# Altium schematic sheet USB3HUB.SchDoc
size A3; SheetNumber: 13; SheetTotal: 13
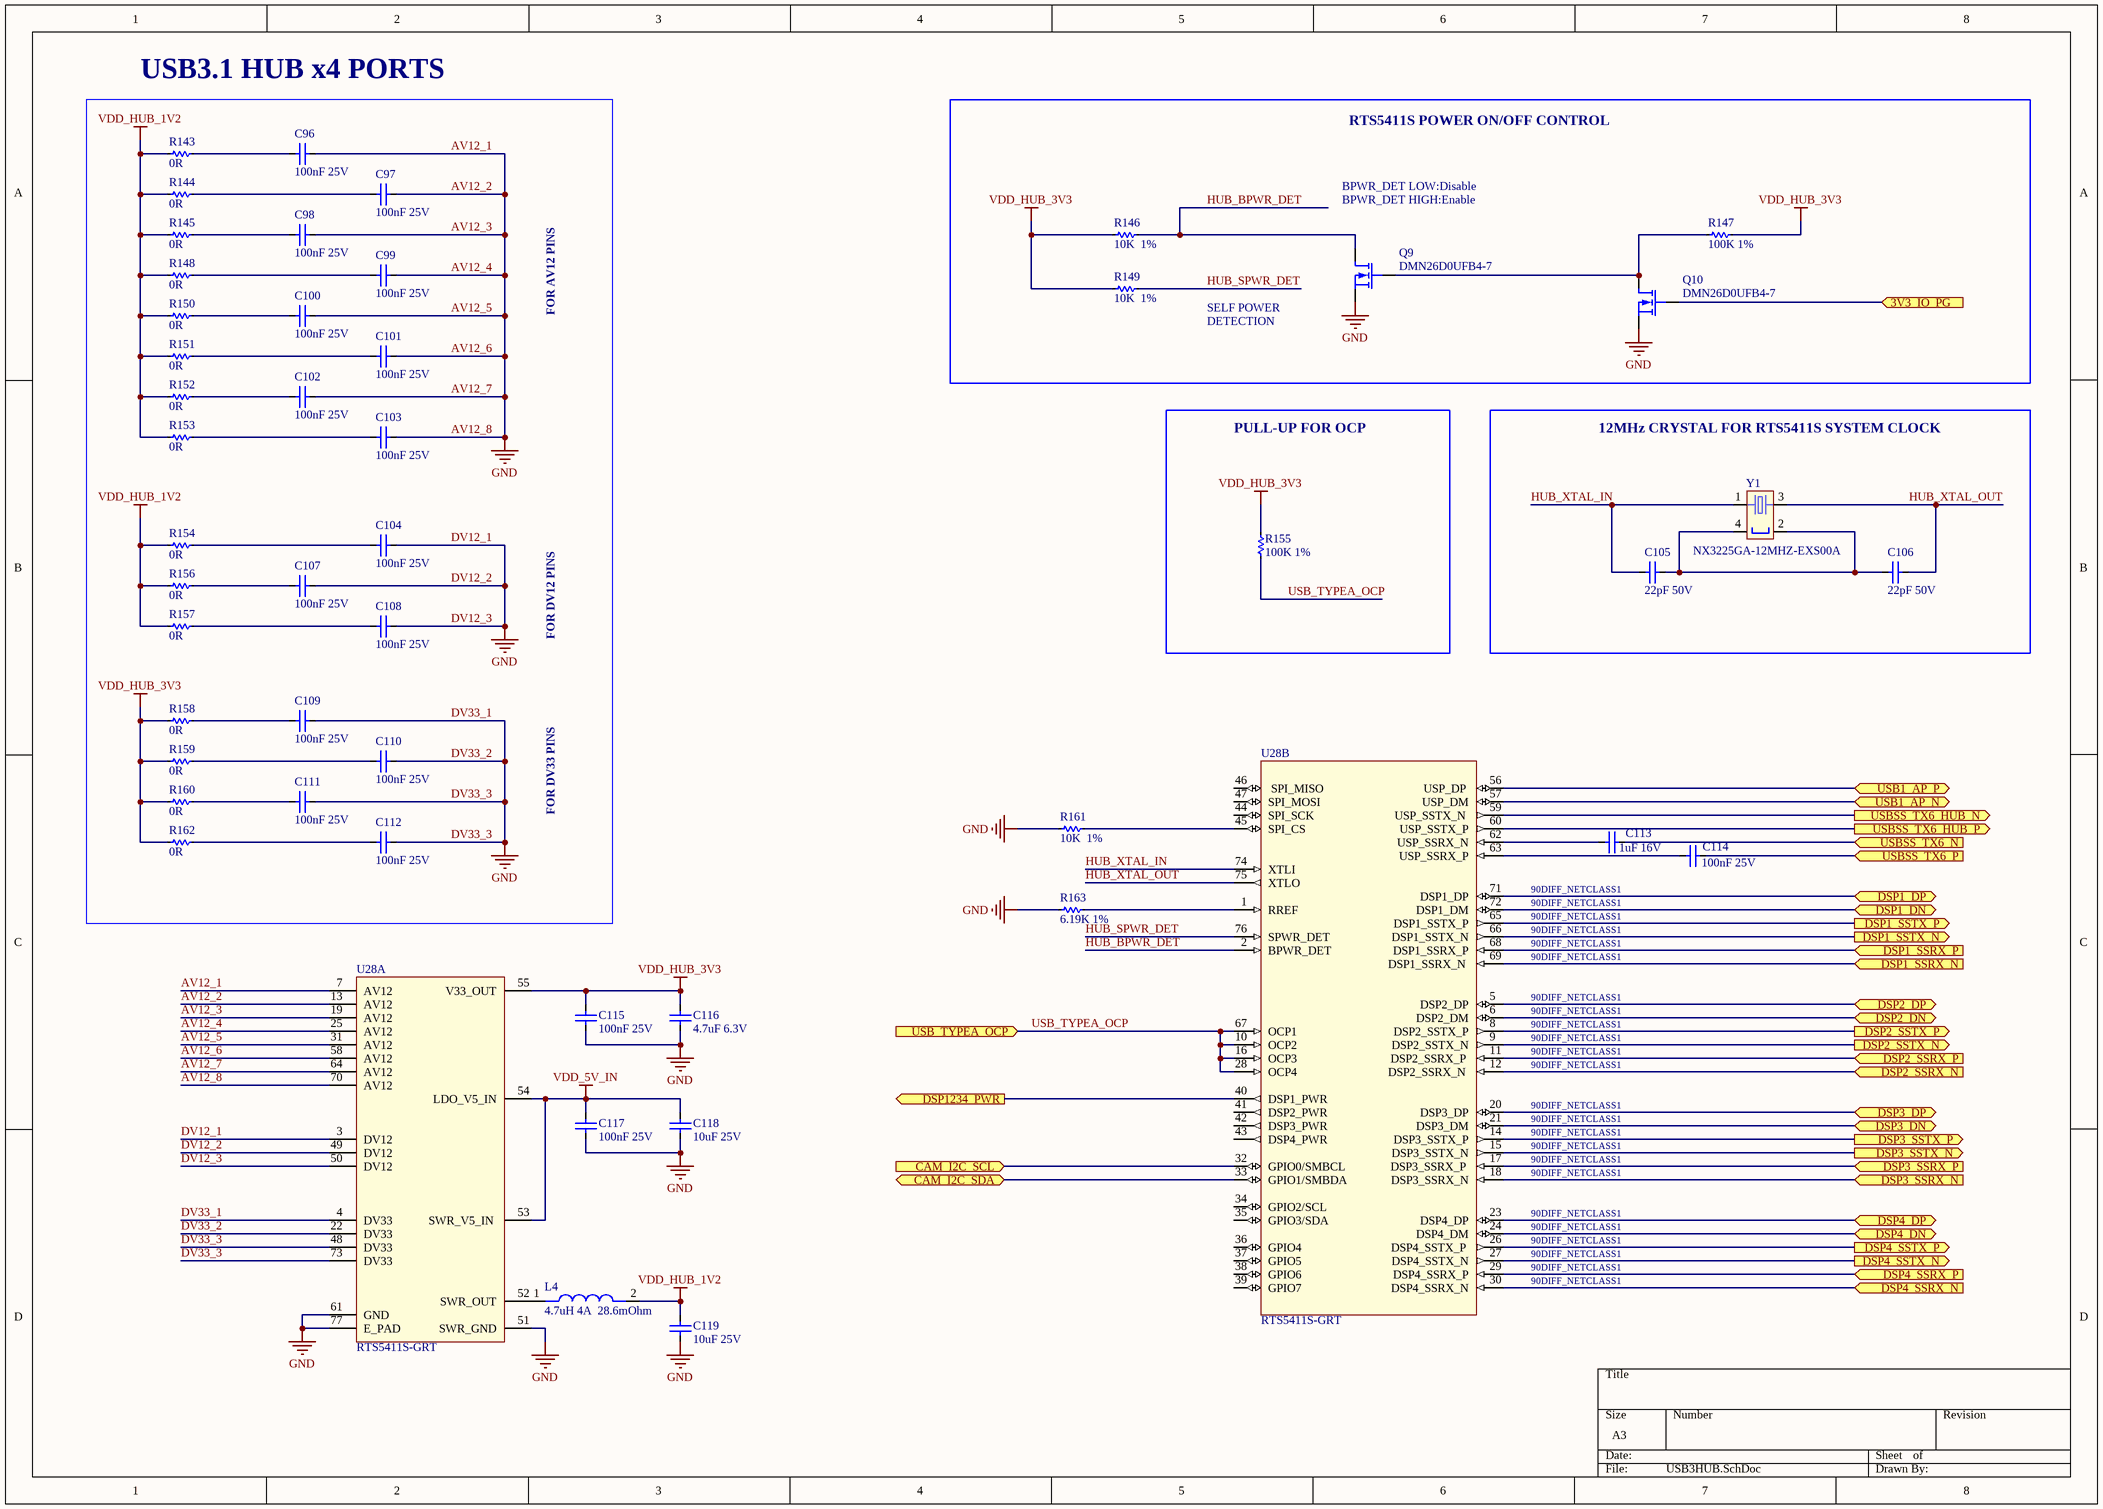
[diagram p0: USB3HUB.SchDoc]

## Parts
C96  100nF 25V  [C0402]
C97  100nF 25V  [C0402]
C98  100nF 25V  [C0402]
C99  100nF 25V  [C0402]
C100  100nF 25V  [C0402]
C101  100nF 25V  [C0402]
C102  100nF 25V  [C0402]
C103  100nF 25V  [C0402]
C104  100nF 25V  [C0402]
C105  22pF 50V  [C0402]
C106  22pF 50V  [C0402]
C107  100nF 25V  [C0402]
C108  100nF 25V  [C0402]
C109  100nF 25V  [C0402]
C110  100nF 25V  [C0402]
C111  100nF 25V  [C0402]
C112  100nF 25V  [C0402]
C113  1uF 16V  [C0603]
C114  100nF 25V  [C0402]
C115  100nF 25V  [C0402]
C116  4.7uF 6.3V  [C0402]
C117  100nF 25V  [C0402]
C118  10uF 25V  [C0805]
C119  10uF 25V  [C0805]
L4  4.7uH 4A  28.6mOhm  [NRS8030T4R7MJGJV]
Q9  DMN26D0UFB4-7  [DFN1006-3]
Q10  DMN26D0UFB4-7  [DFN1006-3]
R143  0R  [R0603]
R144  0R  [R0603]
R145  0R  [R0603]
R146  10K  1%  [R0402]
R147  100K 1%  [R0402]
R148  0R  [R0603]
R149  10K  1%  [R0402]
R150  0R  [R0603]
R151  0R  [R0603]
R152  0R  [R0603]
R153  0R  [R0603]
R154  0R  [R0603]
R155  100K 1%  [R0402]
R156  0R  [R0603]
R157  0R  [R0603]
R158  0R  [R0603]
R159  0R  [R0603]
R160  0R  [R0603]
R161  10K  1%  [R0402]
R162  0R  [R0603]
R163  6.19K 1%  [R0402]
U28  RTS5411S-GRT  [QFN-76]  (parts A,B of 2)
Y1  NX3225GA-12MHZ-EXS00A  [NX3225GA-12MHZ-EXS00A-CG07042]

## Blocks framed on the sheet
USB3.1 HUB x4 PORTS: C96-C104 C107-C112 R143-R145 R148 R150-R154 R156-R160 R162
RTS5411S POWER ON/OFF CONTROL: Q9 Q10 R146 R147 R149
PULL-UP FOR OCP: R155
12MHz CRYSTAL FOR RTS5411S SYSTEM CLOCK: C105 C106 Y1

## Ports
3V3_IO_PG (in), CAM_I2C_SCL (in), CAM_I2C_SDA (bidir), DSP1_DN (bidir), DSP1_DP (bidir), DSP1_SSRX_N (in), DSP1_SSRX_P (in), DSP1_SSTX_N (out), DSP1_SSTX_P (out), DSP2_DN (bidir), DSP2_DP (bidir), DSP2_SSRX_N (in), DSP2_SSRX_P (in), DSP2_SSTX_N (out), DSP2_SSTX_P (out), DSP3_DN (bidir), DSP3_DP (bidir), DSP3_SSRX_N (in), DSP3_SSRX_P (in), DSP3_SSTX_N (out), DSP3_SSTX_P (out), DSP4_DN (bidir), DSP4_DP (bidir), DSP4_SSRX_N (in), DSP4_SSRX_P (in), DSP4_SSTX_N (out), DSP4_SSTX_P (out), DSP1234_PWR (out), USB1_AP_N (bidir), USB1_AP_P (bidir), USB_TYPEA_OCP (in), USBSS_TX6_HUB_N (out), USBSS_TX6_HUB_P (out), USBSS_TX6_N (in), USBSS_TX6_P (in)

## Nets
AV12_1: C96.2 C97.2 C98.2 C99.2 C100.2 C101.2 C102.2 C103.2 C104.2 C107.2 C108.2 C109.2 C110.2 C111.2 C112.2 C115.1 C116.1 C117.1 C118.1 C119.1 Q9.2(S) Q10.2(S) R161.1 R163.1 U28.3(DV12) U28.4(DV33) U28.7(AV12) U28.13(AV12) U28.19(AV12) U28.22(DV33) U28.25(AV12) U28.31(AV12) U28.48(DV33) U28.49(DV12) U28.50(DV12) U28.51(SWR_GND) U28.58(AV12) U28.61(GND) U28.64(AV12) U28.70(AV12) U28.73(DV33) U28.77(E_PAD)  [also labelled AV12_2, AV12_3, AV12_4, AV12_5, AV12_6, AV12_7, AV12_8, DV12_1, DV12_2, DV12_3, DV33_1, DV33_2, DV33_3, GND]
VDD_5V_IN: C117.2 C118.2 U28.53(SWR_V5_IN) U28.54(LDO_V5_IN)
VDD_HUB_1V2: C119.2 L4.2 R143.1 R144.1 R145.1 R148.1 R150.1 R151.1 R152.1 R153.1 R154.1 R156.1 R157.1
VDD_HUB_3V3: C115.2 C116.2 R146.1 R147.2 R149.1 R155.2 R158.1 R159.1 R160.1 R162.1 U28.55(V33_OUT)
3V3_IO_PG: Q10.1(G) ; port 3V3_IO_PG
CAM_I2C_SCL: U28.32(GPIO0/SMBCL) ; port CAM_I2C_SCL
CAM_I2C_SDA: U28.33(GPIO1/SMBDA) ; port CAM_I2C_SDA
DSP1_DN: U28.72(DSP1_DM) ; port DSP1_DN
DSP1_DP: U28.71(DSP1_DP) ; port DSP1_DP
DSP1_SSRX_N: U28.69(DSP1_SSRX_N) ; port DSP1_SSRX_N
DSP1_SSRX_P: U28.68(DSP1_SSRX_P) ; port DSP1_SSRX_P
DSP1_SSTX_N: U28.66(DSP1_SSTX_N) ; port DSP1_SSTX_N
DSP1_SSTX_P: U28.65(DSP1_SSTX_P) ; port DSP1_SSTX_P
DSP2_DN: U28.6(DSP2_DM) ; port DSP2_DN
DSP2_DP: U28.5(DSP2_DP) ; port DSP2_DP
DSP2_SSRX_N: U28.12(DSP2_SSRX_N) ; port DSP2_SSRX_N
DSP2_SSRX_P: U28.11(DSP2_SSRX_P) ; port DSP2_SSRX_P
DSP2_SSTX_N: U28.9(DSP2_SSTX_N) ; port DSP2_SSTX_N
DSP2_SSTX_P: U28.8(DSP2_SSTX_P) ; port DSP2_SSTX_P
DSP3_DN: U28.21(DSP3_DM) ; port DSP3_DN
DSP3_DP: U28.20(DSP3_DP) ; port DSP3_DP
DSP3_SSRX_N: U28.18(DSP3_SSRX_N) ; port DSP3_SSRX_N
DSP3_SSRX_P: U28.17(DSP3_SSRX_P) ; port DSP3_SSRX_P
DSP3_SSTX_N: U28.15(DSP3_SSTX_N) ; port DSP3_SSTX_N
DSP3_SSTX_P: U28.14(DSP3_SSTX_P) ; port DSP3_SSTX_P
DSP4_DN: U28.24(DSP4_DM) ; port DSP4_DN
DSP4_DP: U28.23(DSP4_DP) ; port DSP4_DP
DSP4_SSRX_N: U28.30(DSP4_SSRX_N) ; port DSP4_SSRX_N
DSP4_SSRX_P: U28.29(DSP4_SSRX_P) ; port DSP4_SSRX_P
DSP4_SSTX_N: U28.27(DSP4_SSTX_N) ; port DSP4_SSTX_N
DSP4_SSTX_P: U28.26(DSP4_SSTX_P) ; port DSP4_SSTX_P
DSP1234_PWR: U28.40(DSP1_PWR) ; port DSP1234_PWR
HUB_BPWR_DET: Q9.3(D) R146.2 U28.2(BPWR_DET)
HUB_SPWR_DET: R149.2 U28.76(SPWR_DET)
HUB_XTAL_IN: C105.1 U28.74(XTLI) Y1.1
HUB_XTAL_OUT: C106.1 U28.75(XTLO) Y1.3
USB1_AP_N: U28.57(USP_DM) ; port USB1_AP_N
USB1_AP_P: U28.56(USP_DP) ; port USB1_AP_P
USB_TYPEA_OCP: R155.1 U28.10(OCP2) U28.16(OCP3) U28.28(OCP4) U28.67(OCP1) ; port USB_TYPEA_OCP
USBSS_TX6_HUB_N: U28.59(USP_SSTX_N) ; port USBSS_TX6_HUB_N
USBSS_TX6_HUB_P: U28.60(USP_SSTX_P) ; port USBSS_TX6_HUB_P
USBSS_TX6_N: C113.2 ; port USBSS_TX6_N
USBSS_TX6_P: C114.2 ; port USBSS_TX6_P
NetC96_1: C96.1 R143.2
NetC97_1: C97.1 R144.2
NetC98_1: C98.1 R145.2
NetC99_1: C99.1 R148.2
NetC100_1: C100.1 R150.2
NetC101_1: C101.1 R151.2
NetC102_1: C102.1 R152.2
NetC103_1: C103.1 R153.2
NetC104_1: C104.1 R154.2
NetC105_2: C105.2 C106.2 Y1.2(GND) Y1.4(GND)
NetC107_1: C107.1 R156.2
NetC108_1: C108.1 R157.2
NetC109_1: C109.1 R158.2
NetC110_1: C110.1 R159.2
NetC111_1: C111.1 R160.2
NetC112_1: C112.1 R162.2
NetC113_1: C113.1 U28.62(USP_SSRX_N)
NetC114_1: C114.1 U28.63(USP_SSRX_P)
NetL4_1: L4.1 U28.52(SWR_OUT)
NetQ9_1: Q9.1(G) Q10.3(D) R147.1
NetR161_2: R161.2 U28.45(SPI_CS)
NetR163_2: R163.2 U28.1(RREF)

Not connected (* = marked no-connect by the designer): U28 34(GPIO2/SCL) 35(GPIO3/SDA) 36(GPIO4) 37(GPIO5) 38(GPIO6) 39(GPIO7) 41(DSP2_PWR) 42(DSP3_PWR) 43(DSP4_PWR) 44(SPI_SCK) 46(_SPI_MISO) 47(SPI_MOSI)

## Notes on the sheet
- BPWR_DET LOW:Disable
- BPWR_DET HIGH:Enable
- FOR AV12 PINS
- SELF POWER
- DETECTION
- FOR DV12 PINS
- FOR DV33 PINS
- 90DIFF_NETCLASS1

## Library data of the parts
C96-C104 C107-C112 C114 C115 C117 = TMK105BJ104KV-F: CAP CER 0.1UF 25V X5R 0402 / High Value Multilayer Ceramic Capacitors (High dielectric type); Manufacturer: Taiyo Yuden; Tolerance: 10%; Supplier 1: Digi-Key; Manufacturer Part Number: TMK105BJ104KV-F; RoHS: Yes; Category: Ceramic Capacitors; Stock 1: 11997960; Pricing 1: 1=0.10000, 10=0.03700, 50=0.02000, 100=0.01630, 500=0.01166, 1000=0.00917, 2500=0.00833, 5000=0.00767 (USD); Mount: Surface Mount; Case/Package: 0402; Number of Pins: 2; Case Code (Imperial): 0402; Case Code (Metric): 1005; Weight: 2.3E-05oz; Min Operating Temperature: -55°C; Max Operating Temperature: 85°C; Capacitance: 100nF; Packaging: Tape and Reel; Dielectric: X5R; Voltage Rating (DC): 25V; Voltage Rating: 25V; Package Quantity: 1; Termination: SMD/SMT; Resistor Type: Ceramic; Voltage: 25V; Series: M; Construction: Flat; Length: 1mm; Width: 0.02inch; Height: 0.5mm; Depth: 0.5mm; Thickness: 0.022inch; Reach SVHC Compliant: Yes; Lead Free: Lead Free; Halogen Free: Halogen Free; RoHS Compliant: Yes; Supplier Part Number 1: 587-1456-1-ND
C105 C106 = GRM1555C1H220JA01D: 0402 22pF 50V ±5 % Tolerance C0G SMT Multilayer Ceramic Capacitor; Manufacturer: Murata; Tolerance: 5%; Supplier 1: Mouser; Manufacturer Part Number: GRM1555C1H220JA01D; RoHS: Yes; Category: Ceramic Capacitors; Stock 1: 799894; Pricing 1: 1=0.10000, 10=0.01000, 50=0.01000, 100=0.00800, 1000=0.00500, 10000=0.00300 (USD); Mount: Surface Mount; Case/Package: 0402; Case Code (Metric): 1005; Case Code (Imperial): 0402; Material: Ceramic; Min Operating Temperature: -55°C; Max Operating Temperature: 125°C; Capacitance: 22pF; Voltage Rating: 50V; Packaging: Tape and Reel; Voltage Rating (DC): 50V; Package Quantity: 1; Dielectric: C0G; Termination: SMD/SMT; Voltage: 50V; Series: GRM; Construction: Flat; Length: 1mm; Width: 0.02inch; Height: 0.5mm; Thickness: 0.022inch; Depth: 0.5mm; Radiation Hardening: No; Reach SVHC Compliant: Yes; Lead Free: Lead Free; RoHS Compliant: Yes; ComponentLink1URL: https://datasheet.ciiva.com/6277/product-6277809.pdf?src-supplier=Digi-Key; ComponentLink1Description: https://datasheet.ciiva.com/6277/product-6277809.pdf?src-supplier=Digi-Key; ComponentLink2URL: https://datasheet.ciiva.com/18184/getdatasheetpartid-316063-18184267.pdf?src-supplier=Verical; ComponentLink2Description: https://datasheet.ciiva.com/18184/getdatasheetpartid-316063-18184267.pdf?src-supplier=Verical; ComponentLink3URL: https://datasheet.ciiva.com/29200/453714-da-01-en-vs-kondensator-0402-29200051.pdf?src-supplier=Conrad; ComponentLink3Description: https://datasheet.ciiva.com/29200/453714-da-01-en-vs-kondensator-0402-29200051.pdf?src-supplier=Conrad; ComponentLink4URL: https://datasheet.ciiva.com/7828/1666664-7828846.pdf?src-supplier=Element14; ComponentLink4Description: https://datasheet.ciiva.com/7828/1666664-7828846.pdf?src-supplier=Element14; ComponentLink5URL: https://datasheet.ciiva.com/16440/l0005e-16440552.pdf?src-supplier=Future+Electronics; ComponentLink5Description: https://datasheet.ciiva.com/16440/l0005e-16440552.pdf?src-supplier=Future+Electronics; Supplier Part Number 1: 81-GRM1555C1H220JA1D
C113 = 0603YD105KAT2A: 0603 1 uF 16 V ±10 % Tolerance X5R Surface Mount Multilayer Ceramic Capacitor; Manufacturer: Kyocera AVX; Tolerance: 10%; Dissipation Factor: 12.5%; Insulation Resistance: 10GR; Supplier 1: Digi-Key; Manufacturer Part Number: 0603YD105KAT2A; RoHS: Yes; Category: Ceramic Capacitors; Stock 1: 1533757; Pricing 1: 1=0.12000, 10=0.08200, 50=0.04660, 100=0.03870, 500=0.02710, 1000=0.02244 (USD); Mount: Surface Mount; Case/Package: 0603; Number of Pins: 2; Case Code (Metric): 1608; Case Code (Imperial): 0603; Min Operating Temperature: -55°C; Max Operating Temperature: 85°C; Capacitance: 1uF; Voltage Rating (DC): 16V; Packaging: Tape and Reel; Dielectric: X5R; Voltage: 16V; Voltage Rating: 16V; Package Quantity: 1; Termination: SMD/SMT; Series: -; Construction: Flat; Length: 1.6mm; Width: 0.032inch; Height: 0.9mm; Depth: 0.81mm; Thickness: 0.035inch; Radiation Hardening: No; Reach SVHC Compliant: Yes; Lead Free: Lead Free; RoHS Compliant: Yes; ComponentLink1URL: https://datasheet.ciiva.com/11788/0900766b80def1a5-11788563.pdf?src-supplier=RSComponents; ComponentLink1Description: https://datasheet.ciiva.com/11788/0900766b80def1a5-11788563.pdf?src-supplier=RSComponents; ComponentLink2URL: https://datasheet.ciiva.com/34303/2012654-34303835.pdf?src-supplier=Jameco; ComponentLink2Description: https://datasheet.ciiva.com/34303/2012654-34303835.pdf?src-supplier=Jameco; ComponentLink3URL: https://datasheet.ciiva.com/2987/cx5r-2987890.pdf?src-supplier=Avnet; ComponentLink3Description: https://datasheet.ciiva.com/2987/cx5r-2987890.pdf?src-supplier=Avnet; ComponentLink4URL: https://datasheet.ciiva.com/5412/cx5r-5412550.pdf?src-supplier=Mouser; ComponentLink4Description: https://datasheet.ciiva.com/5412/cx5r-5412550.pdf?src-supplier=Mouser; ComponentLink5URL: https://datasheet.ciiva.com/150/cx5r-150392.pdf?src-supplier=Digi-Key; ComponentLink5Description: https://datasheet.ciiva.com/150/cx5r-150392.pdf?src-supplier=Digi-Key; ComponentLink6URL: https://datasheet.ciiva.com/14590/70001028-14590632.pdf?src-supplier=Allied+Electronics; ComponentLink6Description: https://datasheet.ciiva.com/14590/70001028-14590632.pdf?src-supplier=Allied+Electronics; ComponentLink7URL: https://datasheet.ciiva.com/150/cx5r-150393.pdf?src-supplier=Digi-Key; ComponentLink7Description: https://datasheet.ciiva.com/150/cx5r-150393.pdf?src-supplier=Digi-Key; ComponentLink8URL: https://datasheet.ciiva.com/1458/84508-1458137.pdf?src-supplier=Element14; ComponentLink8Description: https://datasheet.ciiva.com/1458/84508-1458137.pdf?src-supplier=Element14; ComponentLink9URL: https://datasheet.ciiva.com/150/cx5r-150394.pdf?src-supplier=Digi-Key; ComponentLink9Description: https://datasheet.ciiva.com/150/cx5r-150394.pdf?src-supplier=Digi-Key; ComponentLink10URL: https://datasheet.ciiva.com/1458/84508-1458138.pdf?src-supplier=Element14; ComponentLink10Description: https://datasheet.ciiva.com/1458/84508-1458138.pdf?src-supplier=Element14; ComponentLink11URL: https://datasheet.ciiva.com/14586/70001028-14586715.pdf?src-supplier=Allied+Electronics; ComponentLink11Description: https://datasheet.ciiva.com/14586/70001028-14586715.pdf?src-supplier=Allied+Electronics; Supplier Part Number 1: 478-1249-1-ND
C116 = CL05A475KQ5NRNC: CAP CER 4.7UF 6.3V X5R 0402; Manufacturer: Samsung; Tolerance: 10%; Supplier 1: Mouser; Manufacturer Part Number: CL05A475KQ5NRNC; RoHS: Yes; Category: Ceramic Capacitors; Stock 1: 700040; Pricing 1: 1=0.10000, 10=0.03800, 50=0.03800, 100=0.03100, 1000=0.01800, 10000=0.01200 (USD); Mount: Surface Mount; Case/Package: 0402; Case Code (Metric): 1005; Case Code (Imperial): 0402; Contact Plating: Tin; Min Operating Temperature: -55°C; Max Operating Temperature: 85°C; Package Quantity: 1; Packaging: Tape and Reel; Capacitance: 4.7uF; Voltage Rating: 6.3V; Dielectric: X5R; Series: CL; Construction: Flat; Length: 1mm; Width: 0.02inch; Height: 0.5mm; Thickness: 0.022inch; Depth: 0.5mm; Radiation Hardening: No; Lead Free: Lead Free; RoHS Compliant: Yes; ComponentLink1URL: https://datasheet.ciiva.com/25793/cl05a475kq5nrnc-25793634.pdf?src-supplier=Digi-Key; ComponentLink1Description: https://datasheet.ciiva.com/25793/cl05a475kq5nrnc-25793634.pdf?src-supplier=Digi-Key; ComponentLink2URL: https://datasheet.ciiva.com/26838/getdatasheetpartid-353228-26838196.pdf?src-supplier=Verical; ComponentLink2Description: https://datasheet.ciiva.com/26838/getdatasheetpartid-353228-26838196.pdf?src-supplier=Verical; Supplier Part Number 1: 187-CL05A475KQ5NRNC
C118 C119 = TMK212BBJ106KG-T: 0805 10 uF 25 V ±10% Tolerance X5R SMT Multilayer Ceramic Capacitor; Manufacturer: Taiyo Yuden; Dielectric: X7R; Voltage: 16V; Supplier 1: Digi-Key; Manufacturer Part Number: TMK212BBJ106KG-T; RoHS: Yes; Category: Ceramic Capacitors; Stock 1: 3515248; Pricing 1: 1=0.18000, 10=0.12400, 50=0.07460, 100=0.06290, 500=0.04306, 1000=0.03810 (USD); Mount: Surface Mount; Case/Package: 0805; Number of Pins: 2; Case Code (Metric): 2012; Case Code (Imperial): 0805; Min Operating Temperature: -55°C; Max Operating Temperature: 85°C; Capacitance: 10uF; Tolerance: 10%; Packaging: Tape and Reel; Voltage Rating (DC): 25V; Package Quantity: 1; Voltage Rating: 25V; Termination: SMD/SMT; Resistor Type: Ceramic; Series: M; Length: 0.079inch; Width: 0.049inch; Height: 1.25mm; Thickness: 0.053inch; Lead Free: Lead Free; Reach SVHC Compliant: Yes; RoHS Compliant: Yes; ComponentLink1URL: https://datasheet.ciiva.com/30062/tmk212bbj106kg-t-30062083.pdf?src-supplier=Onlinecomponents.com; ComponentLink1Description: https://datasheet.ciiva.com/30062/tmk212bbj106kg-t-30062083.pdf?src-supplier=Onlinecomponents.com; ComponentLink2URL: https://datasheet.ciiva.com/7975/1481447-7975820.pdf?src-supplier=Element14; ComponentLink2Description: https://datasheet.ciiva.com/7975/1481447-7975820.pdf?src-supplier=Element14; ComponentLink3URL: https://datasheet.ciiva.com/139/mlcc-all-e-139571.pdf?src-supplier=Digi-Key; ComponentLink3Description: https://datasheet.ciiva.com/139/mlcc-all-e-139571.pdf?src-supplier=Digi-Key; ComponentLink4URL: https://datasheet.ciiva.com/139/mlcc-all-e-139570.pdf?src-supplier=Digi-Key; ComponentLink4Description: https://datasheet.ciiva.com/139/mlcc-all-e-139570.pdf?src-supplier=Digi-Key; ComponentLink5URL: https://datasheet.ciiva.com/139/mlcc-all-e-139572.pdf?src-supplier=Digi-Key; ComponentLink5Description: https://datasheet.ciiva.com/139/mlcc-all-e-139572.pdf?src-supplier=Digi-Key; Supplier Part Number 1: 587-2985-1-ND
L4 = NRS8030T4R7MJGJV: Inductor Power Shielded Wirewound 4.7uH 20% 100KHz Ferrite 4A 0.0286Ohm DCR 3131 Automotive T/R; Manufacturer: Taiyo Yuden; Saturation Current: 3.6A; DC Resistance (DCR): 28.6mR; Self Resonant Frequency: 40MHz; Supplier 1: Digi-Key; Manufacturer Part Number: NRS8030T4R7MJGJV; RoHS: Yes; Category: Fixed Inductors; Stock 1: 3216; Pricing 1: 1=0.64000, 10=0.56200, 25=0.52200, 50=0.44160, 100=0.40150, 250=0.37740, 500=0.33724 (USD); Mount: Surface Mount; Case/Package: Nonstandard; Core Material: Ferrite; Min Operating Temperature: -25°C; Max Operating Temperature: 125°C; Package Quantity: 1000; Packaging: Tape and Reel; Tolerance: 20%; Current Rating: 4A; Shielding: Shielded; Resistor Type: Wirewound; Inductance: 4.7uH; Test Frequency: 100kHz; Max DC Current: 4A; Termination: SMD/SMT; Length: 0.315inch; Width: 8mm; Height: 3mm; Height - Seated (Max): 0.118inch; Depth: 8mm; Ratings: AEC-Q200; Radiation Hardening: No; Halogen Free: Halogen Free; RoHS Compliant: Yes; ComponentLink1URL: https://datasheet.ciiva.com/29697/nrs8030t4r7mjgjv-ss-29697432.pdf?src-supplier=Digi-Key; ComponentLink1Description: https://datasheet.ciiva.com/29697/nrs8030t4r7mjgjv-ss-29697432.pdf?src-supplier=Digi-Key; Supplier Part Number 1: 587-3652-1-ND
Q9 Q10 = DMN26D0UFB4-7: Single N-Channel 20 V 350 mW Silicon Surface Mount Mosfet - DFN-3; Manufacturer: Diodes; Rise Time: 7.9ns; Rds On Max: 3R; Input Capacitance: 14.1pF; Continuous Drain Current (ID): 240mA; Drain to Source Resistance: 1.8R; Power Dissipation: 350mW; Turn-Off Delay Time: 13.4ns; Drain to Source Voltage (Vdss): 20V; Turn-On Delay Time: 3.8ns; Fall Time: 15.2ns; Number of Elements: 1; Gate to Source Voltage (Vgs): 10V; On-State Resistance: 10R; FET Type: 1 N-Channel; Supplier 1: Mouser; Manufacturer Part Number: DMN26D0UFB4-7; RoHS: Yes; Category: MOSFETs; Stock 1: 21043; Pricing 1: 1=0.38000, 10=0.32100, 50=0.32100, 100=0.17000, 1000=0.07700, 10000=0.05000 (USD); Mount: Surface Mount; Case/Package: DFN; Number of Pins: 3; Min Operating Temperature: -55°C; Max Operating Temperature: 150°C; Packaging: Tape and Reel; Package Quantity: 3000; Max Power Dissipation: 350mW; Element Configuration: Single; Number of Channels: 1; Polarity: N-CHANNEL; Series: -; Drain-source On Resistance-Max: 10R; Length: 1.05mm; Width: 0.65mm; Height: 0.35mm; Radiation Hardening: No; Reach SVHC Compliant: Yes; Lead Free: Lead Free; RoHS Compliant: Yes; ComponentLink1URL: https://datasheet.ciiva.com/4443/ds31775-89139-4443083.pdf?src-supplier=Mouser; ComponentLink1Description: https://datasheet.ciiva.com/4443/ds31775-89139-4443083.pdf?src-supplier=Mouser; ComponentLink2URL: https://datasheet.ciiva.com/11176/ds31775-11176556.pdf?src-supplier=Avnet; ComponentLink2Description: https://datasheet.ciiva.com/11176/ds31775-11176556.pdf?src-supplier=Avnet; ComponentLink3URL: https://datasheet.ciiva.com/16434/ds31775-16434037.pdf?src-supplier=Future+Electronics; ComponentLink3Description: https://datasheet.ciiva.com/16434/ds31775-16434037.pdf?src-supplier=Future+Electronics; ComponentLink4URL: https://datasheet.ciiva.com/48532/ds31775-48532486.pdf?src-supplier=Avnet; ComponentLink4Description: https://datasheet.ciiva.com/48532/ds31775-48532486.pdf?src-supplier=Avnet; ComponentLink5URL: https://datasheet.ciiva.com/934/ds31775-934573.pdf?src-supplier=Digi-Key; ComponentLink5Description: https://datasheet.ciiva.com/934/ds31775-934573.pdf?src-supplier=Digi-Key; ComponentLink6URL: https://datasheet.ciiva.com/934/ds31775-934574.pdf?src-supplier=Digi-Key; ComponentLink6Description: https://datasheet.ciiva.com/934/ds31775-934574.pdf?src-supplier=Digi-Key; ComponentLink7URL: https://datasheet.ciiva.com/934/ds31775-934572.pdf?src-supplier=Digi-Key; ComponentLink7Description: https://datasheet.ciiva.com/934/ds31775-934572.pdf?src-supplier=Digi-Key; Supplier Part Number 1: 621-DMN26D0UFB4-7
R143-R145 R148 R150-R154 R156-R160 R162 = CR0603-J/-000ELF: RES SMD 0 OHM JUMPER 1/10W 0603; Manufacturer: Bourns; Resistance: 0mR; Power Rating: 100mW; Tolerance: 1%; Voltage Rating: 50V; Temperature Coefficient: 500ppm/°C; Resistance Tolerance: 5%; Supplier 1: Digi-Key; Manufacturer Part Number: CR0603-J/-000ELF; RoHS: Yes; Category: Chip SMD Resistors; Stock 1: 1690954; Pricing 1: 1=0.10000, 10=0.01300, 25=0.00960, 50=0.00720, 100=0.00540, 250=0.00408, 500=0.00328, 1000=0.00241 (USD); Mount: Surface Mount; Case/Package: 0603; Number of Pins: 2; Case Code (Imperial): 0603; Case Code (Metric): 1608; Contact Plating: Tin; Min Operating Temperature: -55°C; Max Operating Temperature: 155°C; Packaging: Tape and Reel; Package Quantity: 5000; Resistor Type: Thick Film; Termination: SMD/SMT; Max Power Dissipation: 100mW; Voltage Rating (DC): 50V; Series: CR0603; Technology: THICK FILM; Construction: Rectangular; Features: Moisture Resistant; Number of Terminations: 2; Length: 1.6mm; Width: 0.8mm; Height: 0.45mm; Depth: 0.8mm; Thickness: 457um; Radiation Hardening: No; Reach SVHC Compliant: Yes; Military Standard: Not; RoHS Compliant: Yes; ComponentLink1URL: https://datasheet.ciiva.com/11809/0900766b80fcdb72-11809586.pdf?src-supplier=RSComponents; ComponentLink1Description: https://datasheet.ciiva.com/11809/0900766b80fcdb72-11809586.pdf?src-supplier=RSComponents; ComponentLink2URL: https://datasheet.ciiva.com/7001/1902866-7001645.pdf?src-supplier=Newark; ComponentLink2Description: https://datasheet.ciiva.com/7001/1902866-7001645.pdf?src-supplier=Newark; ComponentLink3URL: https://datasheet.ciiva.com/7986/691949-7986171.pdf?src-supplier=Element14; ComponentLink3Description: https://datasheet.ciiva.com/7986/691949-7986171.pdf?src-supplier=Element14; ComponentLink4URL: https://datasheet.ciiva.com/7660/1856384-7660956.pdf?src-supplier=Element14; ComponentLink4Description: https://datasheet.ciiva.com/7660/1856384-7660956.pdf?src-supplier=Element14; ComponentLink5URL: https://datasheet.ciiva.com/22693/1902866-22693213.pdf?src-supplier=Element14; ComponentLink5Description: https://datasheet.ciiva.com/22693/1902866-22693213.pdf?src-supplier=Element14; ComponentLink6URL: https://datasheet.ciiva.com/5545/chpreztr-5545708.pdf?src-supplier=Mouser; ComponentLink6Description: https://datasheet.ciiva.com/5545/chpreztr-5545708.pdf?src-supplier=Mouser; ComponentLink7URL: https://datasheet.ciiva.com/16761/70154685-16761515.pdf?src-supplier=Allied+Electronics; ComponentLink7Description: https://datasheet.ciiva.com/16761/70154685-16761515.pdf?src-supplier=Allied+Electronics; ComponentLink8URL: https://datasheet.ciiva.com/30062/159chpreztr-30062601.pdf?src-supplier=Onlinecomponents.com; ComponentLink8Description: https://datasheet.ciiva.com/30062/159chpreztr-30062601.pdf?src-supplier=Onlinecomponents.com; ComponentLink9URL: https://datasheet.ciiva.com/48692/001055497-da-01-en-smd-wid-cr0603-j-000elf-0-0-ohm-1-10w-48692135.pdf?src-supplier=Conrad; ComponentLink9Description: https://datasheet.ciiva.com/48692/001055497-da-01-en-smd-wid-cr0603-j-000elf-0-0-ohm-1-10w-48692135.pdf?src-supplier=Conrad; Supplier Part Number 1: CR0603-J/-000ELFCT-ND
R146 R149 R161 = RC0402FR-0710KP: Res General Purpose Thick Film 0402 10K Ohm 1% 1/16W ±100ppm/°C Molded SMD Paper T/R; Manufacturer: Yageo; Resistance: 10kR; Max Power Dissipation: 63mW; Temperature Coefficient: 150ppm/°C; Supplier 1: Digi-Key; Manufacturer Part Number: RC0402FR-0710KP; RoHS: Yes; Category: Chip SMD Resistors; Stock 1: 1032587; Pricing 1: 1=0.10000, 10=0.03100, 100=0.01280, 1000=0.00573, 2500=0.00497, 5000=0.00411 (USD); Case/Package: 0402; Case Code (Metric): 1005; Case Code (Imperial): 0402; Min Operating Temperature: -55°C; Max Operating Temperature: 155°C; Packaging: Tape and Reel; Resistor Type: Thick Film; Number of Terminations: 2; Tolerance: 1%; Features: Moisture Resistant; Length: 0.039inch; Width: 0.02inch; Height: 0.016inch; RoHS Compliant: Yes; ComponentLink1URL: http://www.yageo.com/NewPortal/yageodocoutput?fileName=/pdf/R-Chip/PYu-RC_51_RoHS_P_0.pdf&src-supplier=Digi-Key; ComponentLink1Description: http://www.yageo.com/NewPortal/yageodocoutput?fileName=/pdf/R-Chip/PYu-RC_51_RoHS_P_0.pdf&src-supplier=Digi-Key; Supplier Part Number 1: YAG1249CT-ND
R147 R155 = RC0402FR-07100KL: RES SMD 100K OHM 1% 1/16W 0402; Manufacturer: Yageo; Power Rating: 63mW; Voltage Rating: 50V; Resistance: 100kR; Temperature Coefficient: 100ppm/°C; Supplier 1: Digi-Key; Manufacturer Part Number: RC0402FR-07100KL; RoHS: Yes; Category: Chip SMD Resistors; Stock 1: 41082272; Pricing 1: 1=0.10000, 10=0.01400, 100=0.00580, 1000=0.00262, 2500=0.00228, 5000=0.00188 (USD); Case/Package: 0402; Case Code (Metric): 1005; Case Code (Imperial): 0402; Min Operating Temperature: -55°C; Max Operating Temperature: 155°C; Tolerance: 1%; Package Quantity: 1; Packaging: Tape and Reel; Resistor Type: Thick Film; Number of Terminations: 2; Termination: SMD/SMT; Max Power Dissipation: 63mW; Working Voltage: 50V; Features: Moisture Resistant; Series: RC; Resistance Tolerance: 1%; Construction: Rectangular; Technology: THICK FILM; Length: 0.039inch; Width: 0.02inch; Height: 0.016inch; Depth: 0.5mm; Reach SVHC Compliant: Yes; Military Standard: Not; Lead Free: Lead Free; RoHS Compliant: Yes; ComponentLink1URL: https://datasheet.ciiva.com/11819/0900766b80c66297-11819452.pdf?src-supplier=RSComponents; ComponentLink1Description: https://datasheet.ciiva.com/11819/0900766b80c66297-11819452.pdf?src-supplier=RSComponents; ComponentLink2URL: https://datasheet.ciiva.com/22747/1018594-22747509.pdf?src-supplier=Element14; ComponentLink2Description: https://datasheet.ciiva.com/22747/1018594-22747509.pdf?src-supplier=Element14; ComponentLink3URL: https://datasheet.ciiva.com/2453/pyu-r-int-thick-7-2453362.pdf?src-supplier=Digi-Key; ComponentLink3Description: https://datasheet.ciiva.com/2453/pyu-r-int-thick-7-2453362.pdf?src-supplier=Digi-Key; ComponentLink4URL: https://datasheet.ciiva.com/2453/pyu-r-int-thick-7-2453363.pdf?src-supplier=Digi-Key; ComponentLink4Description: https://datasheet.ciiva.com/2453/pyu-r-int-thick-7-2453363.pdf?src-supplier=Digi-Key; ComponentLink5URL: https://datasheet.ciiva.com/2453/pyu-r-int-thick-7-2453361.pdf?src-supplier=Digi-Key; ComponentLink5Description: https://datasheet.ciiva.com/2453/pyu-r-int-thick-7-2453361.pdf?src-supplier=Digi-Key; ComponentLink6URL: https://datasheet.ciiva.com/12667/pyu-rc0402-51-rohs-l-6-r-12667930.pdf?src-supplier=Mouser; ComponentLink6Description: https://datasheet.ciiva.com/12667/pyu-rc0402-51-rohs-l-6-r-12667930.pdf?src-supplier=Mouser; ComponentLink7URL: https://datasheet.ciiva.com/15189/getdatasheetpartid-323696-15189334.pdf?src-supplier=Verical; ComponentLink7Description: https://datasheet.ciiva.com/15189/getdatasheetpartid-323696-15189334.pdf?src-supplier=Verical; Supplier Part Number 1: 311-100KLRCT-ND
R163 = RC0402FR-076K19L: Res Thick Film 0402 6.19K Ohm 1% 1/16W ±100ppm/°C Molded SMD Paper T/R; Manufacturer: Yageo; Resistance: 6.19kR; Power Rating: 62.5mW; Voltage Rating (DC): 50V; Max Power Dissipation: 63mW; Supplier 1: Digi-Key; Manufacturer Part Number: RC0402FR-076K19L; RoHS: Yes; Category: Chip SMD Resistors; Stock 1: 292090; Pricing 1: 1=0.10000, 10=0.01400, 100=0.00580, 1000=0.00262, 2500=0.00228, 5000=0.00188 (USD); Case/Package: 0402; Case Code (Imperial): 0402; Case Code (Metric): 1005; Contact Plating: Tin,Matte; Size Code: 0402; Min Operating Temperature: -55°C; Max Operating Temperature: 155°C; Packaging: Tape and Reel; Tolerance: 1%; Resistor Type: Thick Film; Temperature Coefficient: 100ppm/°C; Features: Moisture Resistant; Series: RC; Number of Terminations: 2; Construction: Rectangular; Voltage Rating: 50V; Termination: SMD/SMT; Length: 1mm; Depth: 0.5mm; Military Standard: Not; Lead Free: Lead Free; RoHS Compliant: Yes; ComponentLink1URL: https://datasheet.ciiva.com/8892/pyu-rc0402-51-rohs-l-6-8892361.pdf?src-supplier=Avnet; ComponentLink1Description: https://datasheet.ciiva.com/8892/pyu-rc0402-51-rohs-l-6-8892361.pdf?src-supplier=Avnet; ComponentLink2URL: https://datasheet.ciiva.com/17066/pyu-rc0402-51-rohs-l-6-r-17066229.pdf?src-supplier=Future+Electronics; ComponentLink2Description: https://datasheet.ciiva.com/17066/pyu-rc0402-51-rohs-l-6-r-17066229.pdf?src-supplier=Future+Electronics; Supplier Part Number 1: 311-6.19KLRCT-ND
U28 = RTS5411S-GRT: USB 3.0 Super-Speed HUB Controller, 76-pin QFN (9 x9 mm) package; ComponentLink1Description: Datasheet; ComponentLink1URL: https://datasheetspdf.com/pdf-file/1146777/Realtek/RTS5411/1
Y1 = NX3225GA-12MHZ-EXS00A-CG07042: Crystal 12.0000MHZ 10PF SMD; Manufacturer: NDK; Supplier 1: Digi-Key; Manufacturer Part Number: NX3225GA-12MHZ-EXS00A-CG07042; RoHS: No; Stock 1: 32776; Pricing 1: 1=0.70000, 10=0.58300, 50=0.52500, 100=0.46660, 500=0.44328, 1000=0.37330 (USD); Supplier Part Number 1: 644-1320-6-ND